# EAGLE schematic practice board (EAGLE 6.3)
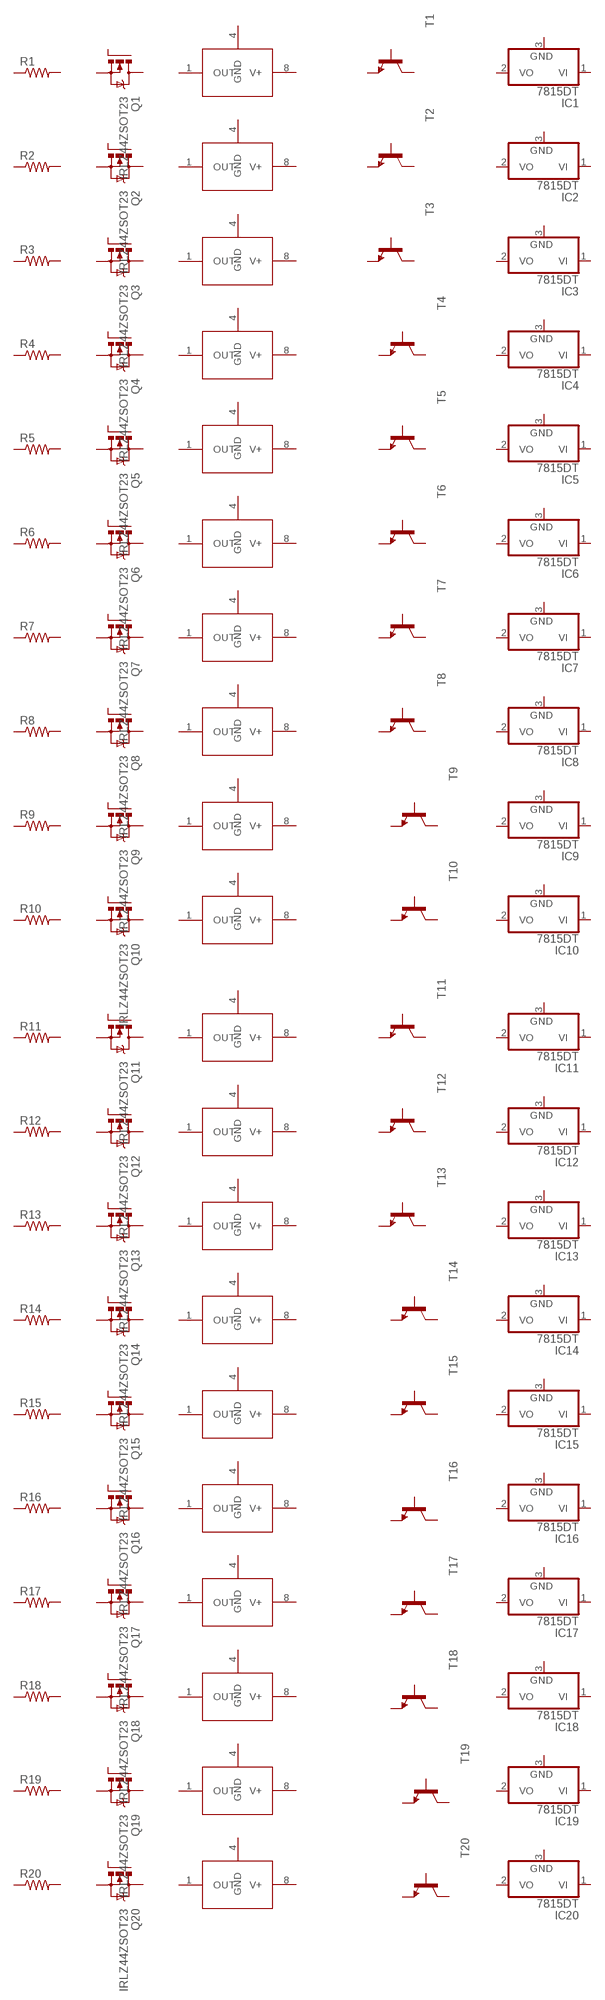
[diagram p0: schematic, sheet 1]

## Parts
IC1  7815DT  [TO252]
IC2  7815DT  [TO252]
IC3  7815DT  [TO252]
IC4  7815DT  [TO252]
IC5  7815DT  [TO252]
IC6  7815DT  [TO252]
IC7  7815DT  [TO252]
IC8  7815DT  [TO252]
IC9  7815DT  [TO252]
IC10  7815DT  [TO252]
IC11  7815DT  [TO252]
IC12  7815DT  [TO252]
IC13  7815DT  [TO252]
IC14  7815DT  [TO252]
IC15  7815DT  [TO252]
IC16  7815DT  [TO252]
IC17  7815DT  [TO252]
IC18  7815DT  [TO252]
IC19  7815DT  [TO252]
IC20  7815DT  [TO252]
Q1  IRLZ44ZSOT23  [SOT23]
Q2  IRLZ44ZSOT23  [SOT23]
Q3  IRLZ44ZSOT23  [SOT23]
Q4  IRLZ44ZSOT23  [SOT23]
Q5  IRLZ44ZSOT23  [SOT23]
Q6  IRLZ44ZSOT23  [SOT23]
Q7  IRLZ44ZSOT23  [SOT23]
Q8  IRLZ44ZSOT23  [SOT23]
Q9  IRLZ44ZSOT23  [SOT23]
Q10  IRLZ44ZSOT23  [SOT23]
Q11  IRLZ44ZSOT23  [SOT23]
Q12  IRLZ44ZSOT23  [SOT23]
Q13  IRLZ44ZSOT23  [SOT23]
Q14  IRLZ44ZSOT23  [SOT23]
Q15  IRLZ44ZSOT23  [SOT23]
Q16  IRLZ44ZSOT23  [SOT23]
Q17  IRLZ44ZSOT23  [SOT23]
Q18  IRLZ44ZSOT23  [SOT23]
Q19  IRLZ44ZSOT23  [SOT23]
Q20  IRLZ44ZSOT23  [SOT23]
R1  R-US_R1206  [R1206]
R2  R-US_R1206  [R1206]
R3  R-US_R1206  [R1206]
R4  R-US_R1206  [R1206]
R5  R-US_R1206  [R1206]
R6  R-US_R1206  [R1206]
R7  R-US_R1206  [R1206]
R8  R-US_R1206  [R1206]
R9  R-US_R1206  [R1206]
R10  R-US_R1206  [R1206]
R11  R-US_R1206  [R1206]
R12  R-US_R1206  [R1206]
R13  R-US_R1206  [R1206]
R14  R-US_R1206  [R1206]
R15  R-US_R1206  [R1206]
R16  R-US_R1206  [R1206]
R17  R-US_R1206  [R1206]
R18  R-US_R1206  [R1206]
R19  R-US_R1206  [R1206]
R20  R-US_R1206  [R1206]
T1  -NPN-SOT223  [SOT223]
T2  -NPN-SOT223  [SOT223]
T3  -NPN-SOT223  [SOT223]
T4  -NPN-SOT223  [SOT223]
T5  -NPN-SOT223  [SOT223]
T6  -NPN-SOT223  [SOT223]
T7  -NPN-SOT223  [SOT223]
T8  -NPN-SOT223  [SOT223]
T9  -NPN-SOT223  [SOT223]
T10  -NPN-SOT223  [SOT223]
T11  -NPN-SOT223  [SOT223]
T12  -NPN-SOT223  [SOT223]
T13  -NPN-SOT223  [SOT223]
T14  -NPN-SOT223  [SOT223]
T15  -NPN-SOT223  [SOT223]
T16  -NPN-SOT223  [SOT223]
T17  -NPN-SOT223  [SOT223]
T18  -NPN-SOT223  [SOT223]
T19  -NPN-SOT223  [SOT223]
T20  -NPN-SOT223  [SOT223]
U$1  LM35  [SO-08]
U$3  LM35  [SO-08]
U$5  LM35  [SO-08]
U$7  LM35  [SO-08]
U$9  LM35  [SO-08]
U$11  LM35  [SO-08]
U$13  LM35  [SO-08]
U$15  LM35  [SO-08]
U$17  LM35  [SO-08]
U$19  LM35  [SO-08]
U$21  LM35  [SO-08]
U$23  LM35  [SO-08]
U$25  LM35  [SO-08]
U$27  LM35  [SO-08]
U$29  LM35  [SO-08]
U$31  LM35  [SO-08]
U$33  LM35  [SO-08]
U$35  LM35  [SO-08]
U$37  LM35  [SO-08]
U$39  LM35  [SO-08]
Unconnected: IC1.1(VI) IC1.2(VO) IC1.3(GND) IC2.1(VI) IC2.2(VO) IC2.3(GND) IC3.1(VI) IC3.2(VO) IC3.3(GND) IC4.1(VI) IC4.2(VO) IC4.3(GND) IC5.1(VI) IC5.2(VO) IC5.3(GND) IC6.1(VI) IC6.2(VO) IC6.3(GND) IC7.1(VI) IC7.2(VO) IC7.3(GND) IC8.1(VI) IC8.2(VO) IC8.3(GND) IC9.1(VI) IC9.2(VO) IC9.3(GND) IC10.1(VI) IC10.2(VO) IC10.3(GND) IC11.1(VI) IC11.2(VO) IC11.3(GND) IC12.1(VI) IC12.2(VO) IC12.3(GND) IC13.1(VI) IC13.2(VO) IC13.3(GND) IC14.1(VI) IC14.2(VO) IC14.3(GND) IC15.1(VI) IC15.2(VO) IC15.3(GND) IC16.1(VI) IC16.2(VO) IC16.3(GND) IC17.1(VI) IC17.2(VO) IC17.3(GND) IC18.1(VI) IC18.2(VO) IC18.3(GND) IC19.1(VI) IC19.2(VO) IC19.3(GND) IC20.1(VI) IC20.2(VO) IC20.3(GND) Q1.1(G) Q1.2(S) Q1.3(D) Q2.1(G) Q2.2(S) Q2.3(D) Q3.1(G) Q3.2(S) Q3.3(D) Q4.1(G) Q4.2(S) Q4.3(D) Q5.1(G) Q5.2(S) Q5.3(D) Q6.1(G) Q6.2(S) Q6.3(D) Q7.1(G) Q7.2(S) Q7.3(D) Q8.1(G) Q8.2(S) Q8.3(D) Q9.1(G) Q9.2(S) Q9.3(D) Q10.1(G) Q10.2(S) Q10.3(D) Q11.1(G) Q11.2(S) Q11.3(D) Q12.1(G) Q12.2(S) Q12.3(D) Q13.1(G) Q13.2(S) Q13.3(D) Q14.1(G) Q14.2(S) Q14.3(D) Q15.1(G) Q15.2(S) Q15.3(D) Q16.1(G) Q16.2(S) Q16.3(D) Q17.1(G) Q17.2(S) Q17.3(D) Q18.1(G) Q18.2(S) Q18.3(D) Q19.1(G) Q19.2(S) Q19.3(D) Q20.1(G) Q20.2(S) Q20.3(D) R1.1 R1.2 R2.1 R2.2 R3.1 R3.2 R4.1 R4.2 R5.1 R5.2 R6.1 R6.2 R7.1 R7.2 R8.1 R8.2 R9.1 R9.2 R10.1 R10.2 R11.1 R11.2 R12.1 R12.2 R13.1 R13.2 R14.1 R14.2 R15.1 R15.2 R16.1 R16.2 R17.1 R17.2 R18.1 R18.2 R19.1 R19.2 R20.1 R20.2 T1.1(B) T1.3(E) T1.4(C) T2.1(B) T2.3(E) T2.4(C) T3.1(B) T3.3(E) T3.4(C) T4.1(B) T4.3(E) T4.4(C) T5.1(B) T5.3(E) T5.4(C) T6.1(B) T6.3(E) T6.4(C) T7.1(B) T7.3(E) T7.4(C) T8.1(B) T8.3(E) T8.4(C) T9.1(B) T9.3(E) T9.4(C) T10.1(B) T10.3(E) T10.4(C) T11.1(B) T11.3(E) T11.4(C) T12.1(B) T12.3(E) T12.4(C) T13.1(B) T13.3(E) T13.4(C) T14.1(B) T14.3(E) T14.4(C) T15.1(B) T15.3(E) T15.4(C) T16.1(B) T16.3(E) T16.4(C) T17.1(B) T17.3(E) T17.4(C) T18.1(B) T18.3(E) T18.4(C) T19.1(B) T19.3(E) T19.4(C) T20.1(B) T20.3(E) T20.4(C) U$1.1(OUT) U$1.4(GND) U$1.8(V+) U$3.1(OUT) U$3.4(GND) U$3.8(V+) U$5.1(OUT) U$5.4(GND) U$5.8(V+) U$7.1(OUT) U$7.4(GND) U$7.8(V+) U$9.1(OUT) U$9.4(GND) U$9.8(V+) U$11.1(OUT) U$11.4(GND) U$11.8(V+) U$13.1(OUT) U$13.4(GND) U$13.8(V+) U$15.1(OUT) U$15.4(GND) U$15.8(V+) U$17.1(OUT) U$17.4(GND) U$17.8(V+) U$19.1(OUT) U$19.4(GND) U$19.8(V+) U$21.1(OUT) U$21.4(GND) U$21.8(V+) U$23.1(OUT) U$23.4(GND) U$23.8(V+) U$25.1(OUT) U$25.4(GND) U$25.8(V+) U$27.1(OUT) U$27.4(GND) U$27.8(V+) U$29.1(OUT) U$29.4(GND) U$29.8(V+) U$31.1(OUT) U$31.4(GND) U$31.8(V+) U$33.1(OUT) U$33.4(GND) U$33.8(V+) U$35.1(OUT) U$35.4(GND) U$35.8(V+) U$37.1(OUT) U$37.4(GND) U$37.8(V+) U$39.1(OUT) U$39.4(GND) U$39.8(V+)

## Library data of the parts
IC1-IC20 = linear:78*: Positive VOLTAGE REGULATOR Source: http://cache.national.com/ds/LM/LM78L05.pdf http://www.fairchildsemi.com/ds/LM/LM7805.pdf
Q1-Q20 = SolarJackets_Common:IRLZ44Z: N channel mosfet
R1-R20 = rcl:R-US_: RESISTOR, American symbol
T1-T20 = transistor-neu-to92:*-NPN-: NPN Transistror
U$1 U$3 U$5 U$7 U$9 U$11 U$13 U$15 U$17 U$19 U$21 U$23 U$25 U$27 U$29 U$31 U$33 U$35 U$37 U$39 = SolarJackets_Common:LM35